# EAGLE design sensor-fusion (EAGLE 9.6.2)
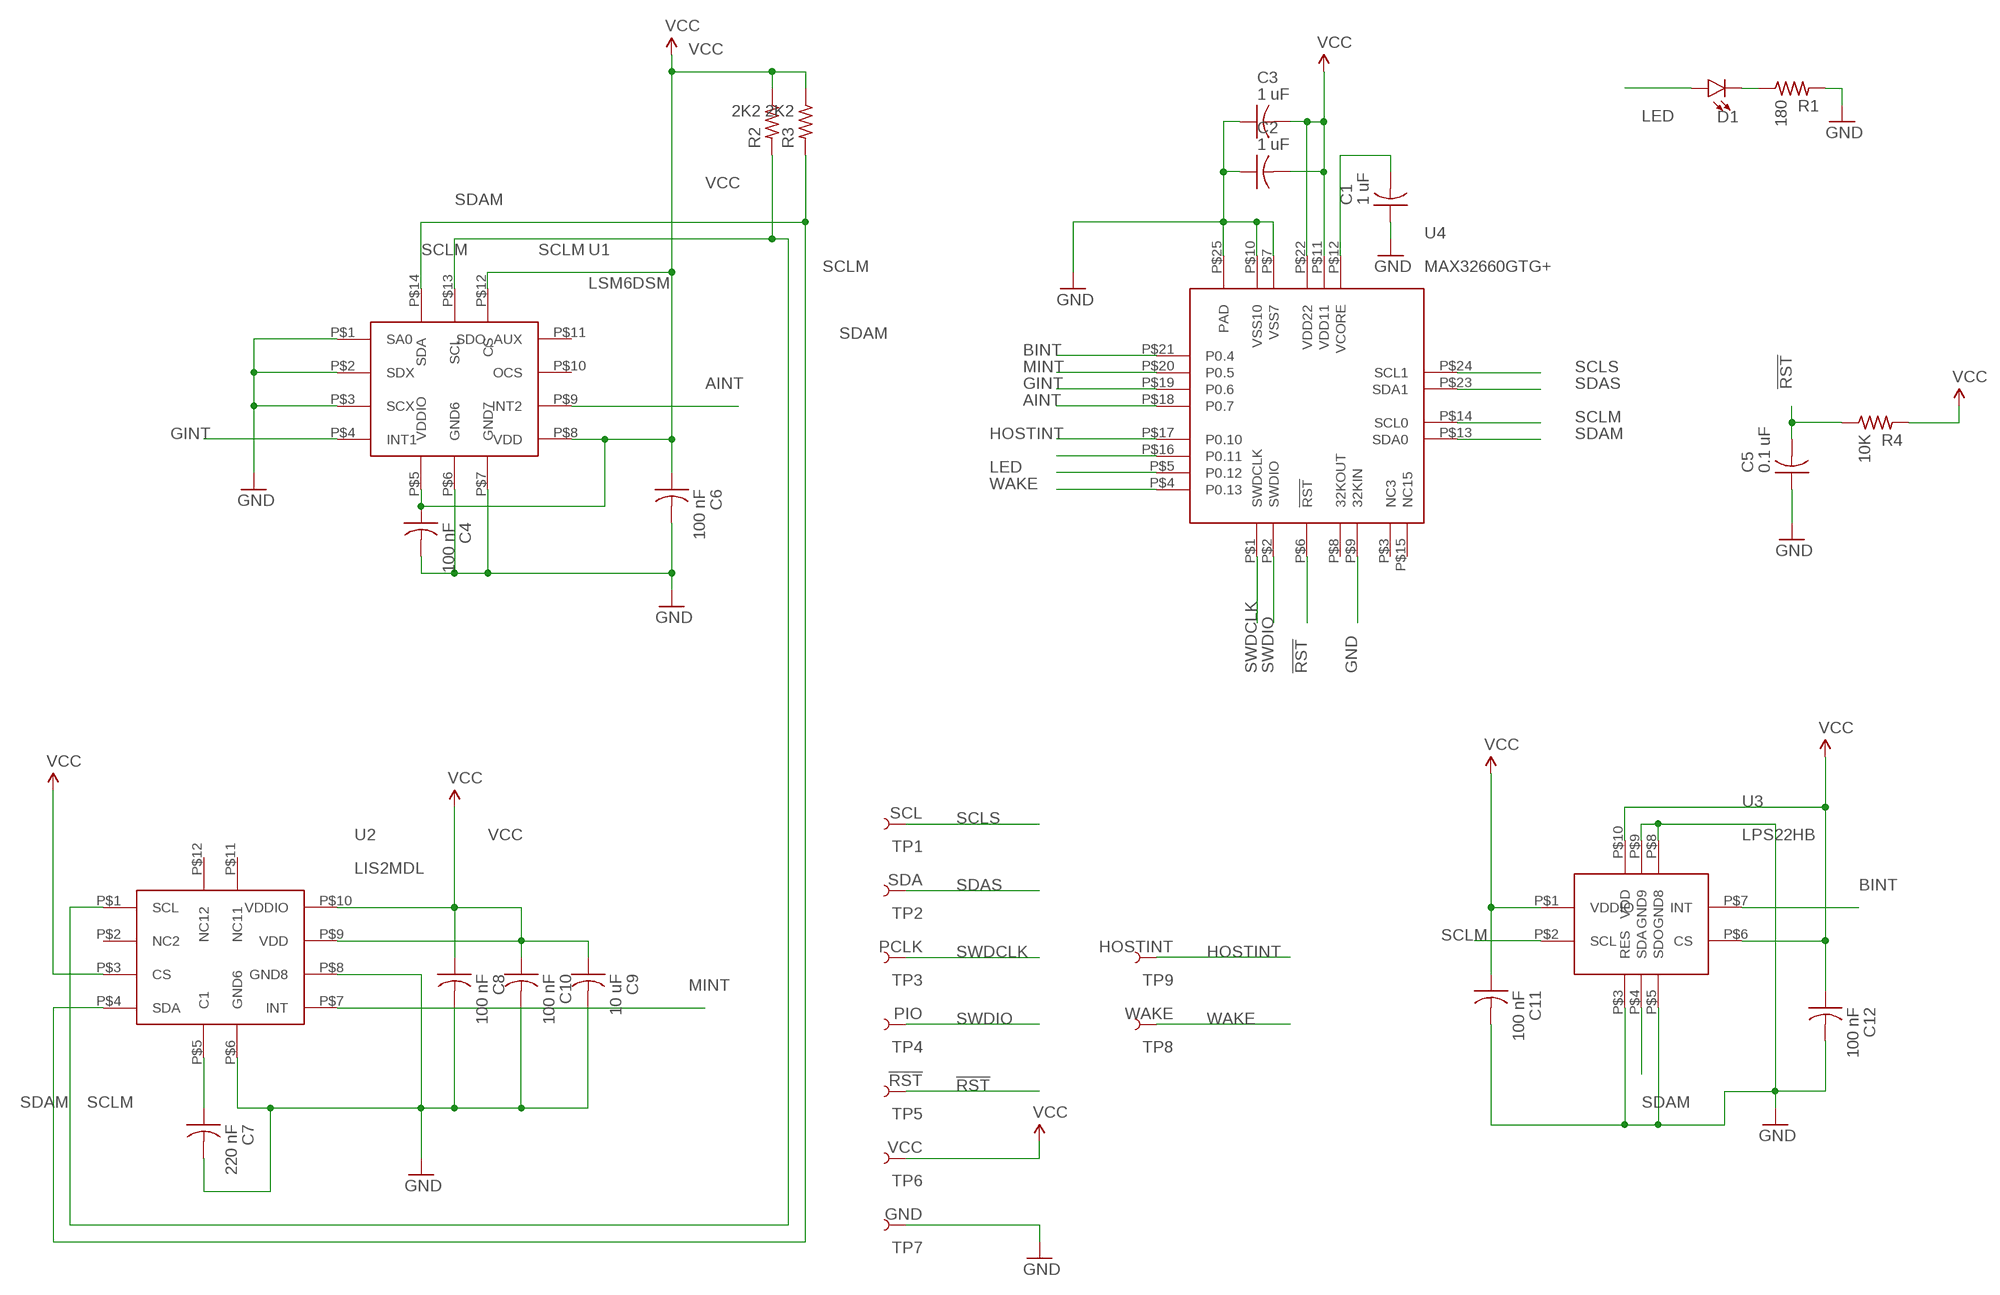
[diagram p0: schematic, sheet 1]

## Parts
C1  1 uF  C-US  [C0402_B]
C2  1 uF  C-US  [C0402_B]
C3  1 uF  C-US  [C0402_B]
C4  100 nF  C-US  [C0402_B]
C5  0.1 uF  C-US  [C0402_B]
C6  100 nF  C-US  [C0402_B]
C7  220 nF  C-US  [C0402_B]
C8  100 nF  C-US  [C0402_B]
C9  10 uF  C-US  [C0402_B]
C10  100 nF  C-US  [C0402_B]
C11  100 nF  C-US  [C0402_B]
C12  100 nF  C-US  [C0402_B]
D1  LED0603  [LED-0603]
R1  180  R-US_  [R0402_B]
R2  2K2  R-US_  [R0402_B]
R3  2K2  R-US_  [R0402_B]
R4  10K  R-US_  [R0402_B]
TP1  SCL  TEST-POINT3X6  [PAD.03X.06]
TP2  SDA  TEST-POINT3X6  [PAD.03X.06]
TP3  PCLK  TEST-POINT3X6  [PAD.03X.06]
TP4  PIO  TEST-POINT3X6  [PAD.03X.06]
TP5  !RST  TEST-POINT3X6  [PAD.03X.06]
TP6  VCC  TEST-POINT3X6  [PAD.03X.06]
TP7  GND  TEST-POINT3X6  [PAD.03X.06]
TP8  WAKE  TEST-POINT3X6  [PAD.03X.06]
TP9  HOSTINT  TEST-POINT3X6  [PAD.03X.06]
U1  LSM6DSM  [LSM6DSM]
U2  LIS2MDL  [LIS2MDL]
U3  LPS22HB  [LPS22HB]
U4  MAX32660GTG+  [MAX32660GTG+]

## Nets
!RST: C5.2 R4.1 TP5.1 U4.P$6(!RST)
AINT: U1.P$9(INT2) U4.P$18(P0.7)
BINT: U3.P$7(INT) U4.P$21(P0.4)
GINT: U1.P$4(INT1) U4.P$19(P0.6)
GND: C1.1 C2.1 C3.1 C4.2 C5.1 C6.2 C7.2 C8.2 C9.2 C10.2 C11.2 C12.2 R1.2 TP7.1 U1.P$1(SA0) U1.P$2(SDX) U1.P$3(SCX) U1.P$6(GND6) U1.P$7(GND7) U2.P$6(GND6) U2.P$8(GND8) U3.P$3(RES) U3.P$5(SDO) U3.P$8(GND8) U3.P$9(GND9) U4.P$7(VSS7) U4.P$9(32KIN) U4.P$10(VSS10) U4.P$25(PAD)
HOSTINT: TP9.1 U4.P$17(P0.10)
LED: D1.A U4.P$5(P0.12)
MINT: U2.P$7(INT) U4.P$20(P0.5)
N$4: C7.1 U2.P$5(C1)
N$6: C1.2 U4.P$12(VCORE)
N$7: D1.C R1.1
N$8: U4.P$16(P0.11)
SCLM: R2.2 U1.P$13(SCL) U2.P$1(SCL) U3.P$2(SCL) U4.P$14(SCL0)
SCLS: TP1.1 U4.P$24(SCL1)
SDAM: R3.2 U1.P$14(SDA) U2.P$4(SDA) U3.P$4(SDA) U4.P$13(SDA0)
SDAS: TP2.1 U4.P$23(SDA1)
SWDCLK: TP3.1 U4.P$1(SWDCLK)
SWDIO: TP4.1 U4.P$2(SWDIO)
VCC: C2.2 C3.2 C4.1 C6.1 C8.1 C9.1 C10.1 C11.1 C12.1 R2.1 R3.1 R4.2 TP6.1 U1.P$5(VDDIO) U1.P$8(VDD) U1.P$12(CS) U2.P$3(CS) U2.P$9(VDD) U2.P$10(VDDIO) U3.P$1(VDDIO) U3.P$6(CS) U3.P$10(VDD) U4.P$11(VDD11) U4.P$22(VDD22)
WAKE: TP8.1 U4.P$4(P0.13)
Unconnected: U2.P$2(NC2) U2.P$11(NC11) U2.P$12(NC12) U4.P$3(NC3) U4.P$8(32KOUT) U4.P$15(NC15)

## Power pins joined to a net without a drawn wire
OCS: U1.P$10(OCS)
SDO_AUX: U1.P$11(SDO_AUX)

## Library data of the parts
C1-C12 = Spark:C-US: Capacitor
D1 = SparkFun-LED:LED: LED (Generic) Standard schematic elements and footprints for 5mm, 3mm, 1206, and 0603 sized LEDs. Generic LEDs with no color specified.
R1-R4 = Spark:R-US_: 0402 Resistor
TP1-TP9 = test-pad:TEST-POINT: SparkFun Test Points Bare copper test points for troubleshooting or In-Circuit-Testing. These are used by our Production team for verifying production board runs using pogo-pins on test beds. SparkFun Products: SparkFun LSM9DS1 Breakout <https://www.sparkfun.com/products/13284> SparkFun PSOC <https://www.sparkfun.com/products/13714> SparkFun Load Cell Amplifier <https://www.sparkfun.com/products/13879>
U1 = Kris:LSM6DSM: LSM6DSM ST accel/gyro
U2 = Kris:LIS2MDL: LIS2MDL ST magnetomneter
U3 = Kris:LPS22HB: LPS22HB ST pressure sensor http://www.st.com/content/ccc/resource/technical/document/datasheet/bf/c1/4f/23/61/17/44/8a/DM00140895.pdf/files/DM00140895.pdf/jcr:content/translations/en.DM00140895.pdf
U4 = Kris:MAX32660GTG+: MAX32660GTG+ 3 mm x 3 mm 24-pin TQFN package https://pdfserv.maximintegrated.com/land_patterns/90-100089.PDF https://datasheets.maximintegrated.com/en/ds/MAX32660.pdf

## Board
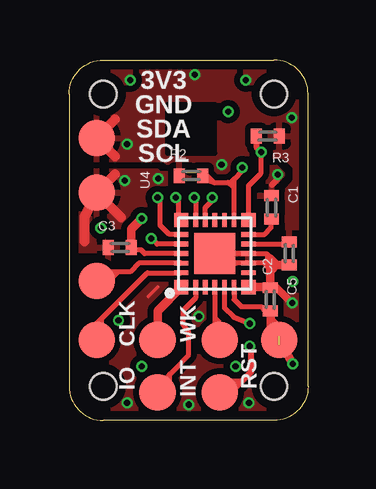
[diagram p1: board, top side]
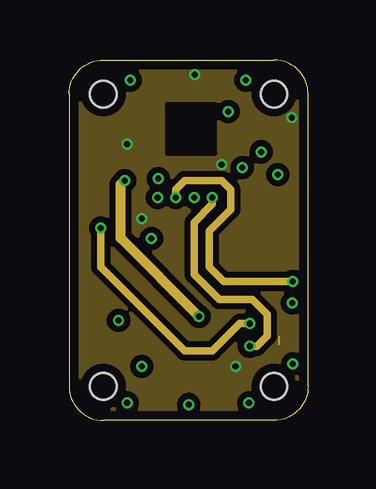
[diagram p2: board, inner layer Route2]
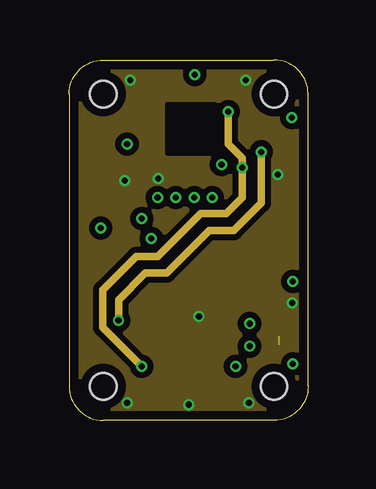
[diagram p3: board, inner layer Route15]
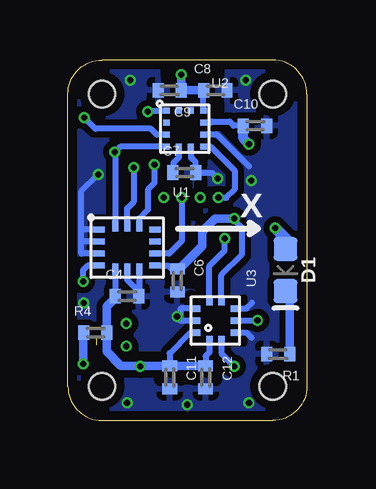
[diagram p4: board, bottom side, seen from below]

Size 9.96 x 15.04 mm. Coordinates in mm from the lower left corner, seen from the top.
Outline: 9.96,1.42 9.96,13.61 arc90 8.53,15.04 1.42,15.04 arc90 0,13.61 0,1.42 arc90 1.42,0 8.53,0 arc90 9.96,1.42
Copper layers (1*2*15*16): Top 0.035559375mm / dielectric 0.17018125mm / Route2 0.01778125mm / dielectric 47mil / Route15 0.01778125mm / dielectric 0.17018125mm / Bottom 0.035559375mm
Design rules "OSHPark-4layer *": minimum track width 5mil, minimum drill 10mil, track to track 5mil, track to pad 5mil, pad to pad 5mil, via to via 5mil, smd to smd 5mil, copper to edge 15mil, drill to drill 6mil, minimum pad ring 4mil, minimum via ring 4mil, stop-mask expansion 4mil, vias tented up to drill 20mil, thermal gap 10mil
Holes 1.1 mm at 1.42,1.42 8.53,1.42 8.53,13.61 1.42,13.61
tRestrict: area 8.9,5.6 to 9,5.6; area 7.8,5.8 to 7.8,5.8; area 7.8,5.3 to 7.8,5.3; area 4.2,4.4 to 4.3,4.5; area 7.9,5.9 to 8.6,7; area 8.4,7.6 to 8.8,7.7; area 9.6,7.4 to 9.7,7.7; area 4.2,4.2 to 4.3,4.4; area 7.3,5.1 to 8.6,5.1; area 8.6,5 to 8.7,5.1; area 9.7,6.5 to 9.8,6.7; area 8.9,6.8 to 9.6,6.9; 11 more areas
bRestrict: area 6.2,8.6 to 6.3,8.6; area 5.7,7.8 to 5.7,7.9; area 5.7,8.4 to 5.7,8.5; area 7.5,5.6 to 7.5,5.6; area 4.6,8.6 to 4.7,8.6; area 4.4,10.8 to 4.4,10.9; area 0.3,6.1 to 1.3,6.4; area 4.4,9.8 to 4.4,9.9; area 4,9.5 to 4.1,9.5; area 7.7,4.4 to 7.9,4.5; area 7.6,4.5 to 7.7,4.7; area 4.4,5.7 to 4.6,6.3; 24 more areas

### Footprints (pad centres in the part's own frame; a part is rotated, then mirrored left to right if it is on the bottom)
C0402_B = smd 0.457 x 0.61: 1 -0.483,0; 2 0.483,0
LED-0603 = smd 1 x 1: A -0.877,0; C 0.877,0
R0402_B = smd 0.457 x 0.61: 1 -0.483,0; 2 0.483,0
PAD.03X.06 = smd 1.524 x 1.524: 1 0,0
LSM6DSM = smd 0.475 x 0.25: P$1 -1.163,0.75; P$2 -1.163,0.25; P$3 -1.163,-0.25; P$4 -1.163,-0.75; P$8 1.163,-0.75; P$9 1.163,-0.25; P$10 1.163,0.25; P$11 1.163,0.75 | smd 0.25 x 0.475: P$5 -0.5,-0.912; P$6 0,-0.912; P$7 0.5,-0.912; P$12 0.5,0.912; P$13 0,0.912; P$14 -0.5,0.912
LIS2MDL = smd 0.275 x 0.25: P$1 -0.765,0.75; P$2 -0.765,0.25; P$3 -0.765,-0.25; P$4 -0.765,-0.75; P$7 0.765,-0.75; P$8 0.765,-0.25; P$9 0.765,0.25; P$10 0.765,0.75 | smd 0.25 x 0.275: P$5 -0.25,-0.765; P$6 0.25,-0.765; P$11 0.25,0.765; P$12 -0.25,0.765
LPS22HB = smd 0.3 x 0.275: P$1 -0.787,0.25; P$2 -0.787,-0.25; P$6 0.787,-0.25; P$7 0.787,0.25 | smd 0.275 x 0.3: P$3 -0.5,-0.787; P$4 0,-0.787; P$5 0.5,-0.787; P$8 0.5,0.787; P$9 0,0.787; P$10 -0.5,0.787
MAX32660GTG+ = smd 0.6 x 0.6: P$1 -1.4,1.4; P$7 -1.4,-1.4; P$13 1.4,-1.4; P$19 1.4,1.4 | smd 0.6 x 0.2: P$2 -1.4,0.8; P$3 -1.4,0.4; P$4 -1.4,0; P$5 -1.4,-0.4; P$6 -1.4,-0.8; P$14 1.4,-0.8; P$15 1.4,-0.4; P$16 1.4,0; P$17 1.4,0.4; P$18 1.4,0.8 | smd 0.2 x 0.6: P$8 -0.8,-1.4; P$9 -0.4,-1.4; P$10 0,-1.4; P$11 0.4,-1.4; P$12 0.8,-1.4; P$20 0.8,1.4; P$21 0.4,1.4; P$22 0,1.4; P$23 -0.4,1.4; P$24 -0.8,1.4 | smd 1.7 x 1.7: P$25 0,0

### Placement (x,y rotation side)
C1  8.43,8.89 270 top
C2  9.17,6.96 90 top
C3  2.11,7.21 0 top
C4  7.49,5.18 0 bottom
C5  8.38,5.05 270 top
C6  5.4,5.84 270 bottom
C7  5.11,10.34 0 bottom
C8  3.81,13.77 0 bottom
C9  5.71,13.77 180 bottom
C10  2.16,12.29 0 bottom
C11  5.71,1.8 270 bottom
C12  4.22,1.8 270 bottom
D1  0.89,6.27 270 bottom
R1  1.19,2.77 180 bottom
R2  5.08,10.21 0 top
R3  8.28,11.86 180 top
R4  8.81,3.66 0 bottom
TP1  1.14,3.35 0 top
TP2  1.14,5.82 0 top
TP3  3.68,3.35 0 top
TP4  3.68,1.17 0 top
TP5  8.76,3.35 0 top
TP6  1.14,11.79 0 top
TP7  1.14,9.5 0 top
TP8  6.27,3.35 0 top
TP9  6.27,1.17 0 top
U1  7.49,7.21 0 bottom
U2  5.08,12.17 0 bottom
U3  3.81,4.17 90 bottom
U4  6.07,6.96 90 top

### Tracks (layer width: path | path; a pad name or v marks a point on that pad's centre or on a via)
!RST  (via drill 0.25)  (2 unrouted)
  Top 0.203: U4.P$6 6.87,5.04 7.16,4.75 8,4.75 8.18,4.57 C5.2 8.41,4.55 | 8.76,3.15 8.86,3.15 8.91,3.21 8.91,3.66
  Top 0.254: 8.94,3.43 8.87,3.51 8.76,3.51
  Top 0.356: 8.91,3.66 8.41,4.17 | 8.41,4.55 8.41,4.17 | 8.41,4.17 8.41,3.86 | TP5.1 v9.32,2.36
  Bottom 0.254: R4.1 9.32,3.63
  Bottom 0.356: 9.32,3.63 v9.32,2.36
AINT  (via drill 0.25)
  Top 0.203: v5.21,9.3 5.27,9.23 U4.P$18
  Bottom 0.203: U1.P$9
  Bottom 0.254: U1.P$9 5.74,6.96 5.21,7.49 v5.21,9.3
BINT  (via drill 0.25)
  Top 0.203: U4.P$21 3.66,7.36 v3.43,7.59
  Bottom 0.203: U3.P$7
  Bottom 0.254: U3.P$7 4.06,6.45 3.43,7.09 v3.43,7.59
CUTOUT
  cutout Route2: 7.75,14.71 7.75,14.33 8.25,14.33 8.25,14.71
  cutout Route2: 1.65,14.71 1.65,14.33 2.16,14.33 2.16,14.71
  cutout Route2: 7.87,0.61 7.87,0.23 8.38,0.23 8.38,0.61
GINT  (via drill 0.25)
  Top 0.203: v4.44,9.3 4.55,9.19 4.55,8.48 U4.P$19
  Route2 0.305: v4.44,9.3 4.44,9.63 4.83,10.01 6.35,10.01 6.73,9.63 6.73,8.79 5.84,7.9 5.84,6.4 6.45,5.79 v9.32,5.79
  Bottom 0.254: U1.P$4 9.13,6.46 9.32,6.27 v9.32,5.79
GND  (via drill 0.25)
  Top 0.152: 3.68,5.56 3.3,5.18
  Top 0.203: 8.22,6.96 U4.P$10 U4.P$25 6.47,6.56 U4.P$9 8.13,6.56 | 8.38,6.56 8.25,6.56 | 8.25,6.56 8.13,6.56 | 8.22,6.96 8.38,6.83 | 8.38,6.83 8.38,6.56 | 8.38,6.56 8.38,6.45 8.41,6.48 | 8.38,6.2 8.38,6.31 8.13,6.56 | 8.38,6.83 8.74,6.48 8.89,6.48 | 8.22,6.96 8.25,6.92 8.25,6.56
  Top 0.254: v9.3,4.9 9.27,4.9 | 8.36,5.56 C5.1 | 8.46,9.83 8.66,10.03
  Top 0.305: 9.27,4.9 8.64,5.54 C5.1
  Top 0.356: U4.P$7 8.36,5.56 | C5.1 8.38,6.2 8.38,6.22 | 8.38,6.22 8.38,6.45 | C2.1 8.89,6.48 8.64,6.48 | 8.64,6.48 8.41,6.48 | 8.38,6.22 8.64,6.48
  Top 0.406: TP7.1 0.64,8.48 0.64,7.47 | TP7.1 2.16,8.48 | TP7.1 1.91,10.26
  Route2 0.406: v5.41,4.34 2.15,7.61 2.15,9.84 v2.31,10.01
  Bottom 0.203: U1.P$6 7.49,5.99 | C4.2 6.97,5.2
  Bottom 0.254: U1.P$1 9.4,7.96 | U1.P$2 9.4,7.46 | U1.P$3 9.4,6.96 9.4,7.46 | U3.P$5 2.52,4.67 2.29,4.9 | U3.P$3 2.52,3.67 2.31,3.45 | 9.4,7.46 9.4,7.96 | U1.P$7 6.99,5.37 | U1.P$6 7.49,5.87 6.99,5.37 | U3.P$8 5.27,4.67 5.27,4.17 U3.P$9 | U2.P$6 4.83,10.98 4.65,10.79 4.65,10.36 C7.2 3.96,10.34 v3.71,10.08 | 6.99,5.37 6.99,5.19 C4.2 | C12.2 4.22,1.24 | 2.41,10.6 3.73,11.92 U2.P$8 | 9.4,7.96 9.4,9.56 v8.7,10.26
  other vias: 7.37,14.2 2.54,14.2 2.41,0.74 4.98,0.66 7.49,0.74
  pour Route15 (isolate 0.254): 1.4,15.09 8.76,15.09 arc-90 10.03,13.82 10.03,1.37 arc-90 8.51,-0.15 1.4,-0.15 arc-90 -0.13,1.37 -0.13,13.56 arc-90
  pour Bottom (isolate 0.254): 1.4,15.09 8.76,15.09 arc-90 10.03,13.82 10.03,1.37 arc-90 8.51,-0.15 1.4,-0.15 arc-90 -0.13,1.37 -0.13,13.56 arc-90
  pour Top (isolate 0.254, rank 2): 1.4,15.09 8.76,15.09 arc-90 10.03,13.82 10.03,1.37 arc-90 8.51,-0.15 1.4,-0.15 arc-90 -0.13,1.37 -0.13,13.56 arc-90
HOSTINT  (via drill 0.25)
  Top 0.203: U4.P$17 5.67,8.87 5.97,9.17 v5.97,9.3
  Top 0.254: v7.52,3.1 7.57,3.05 7.57,2.01 6.73,1.17 TP9.1 | TP9.1 6.73,1.63 7.19,1.63 | 6.22,1.12 TP9.1
  Route2 0.305: v5.97,9.3 5.97,9.02 5.21,8.25 5.21,6.1 6.25,5.05 7.62,5.05 8.25,4.42 8.25,3.53 7.82,3.1 v7.52,3.1
LED  (via drill 0.25)
  Top 0.203: U4.P$5 6.47,4.69 6.86,4.32 v7.52,4.04
  Route2 0.305: v7.52,4.04 7.11,4.04 5.97,2.9 4.83,2.9 1.32,6.4 v1.32,8.03
  Bottom 0.254: 0.95,7.09 D1.A
  Bottom 0.457: v1.32,8.03 1.09,7.8 1.09,7.42 | v1.32,8.03 0.95,7.66 0.95,7.09 | v1.32,8.03 0.66,7.37 0.66,7.21
MINT  (via drill 0.25)
  Top 0.203: U4.P$20 4.18,7.76 3.79,8.15 3.79,9.19 v3.68,9.3
  Bottom 0.203: U2.P$7 4.05,11.4
  Bottom 0.254: U2.P$7 4,11.42 3.01,10.43 3.01,9.64 3.35,9.3 v3.68,9.3
N$1
  cutout Bottom (no thermals): 6.07,13.18 4.09,13.18 4.09,11.15 6.07,11.15
  cutout Route2 (no thermals): 6.07,13.18 4.09,13.18 4.09,11.15 6.07,11.15
  cutout Route15 (no thermals): 6.07,13.18 4.09,13.18 4.09,11.15 6.07,11.15
  cutout Top (no thermals): 6.07,13.18 4.09,13.18 4.09,11.15 6.07,11.15
N$3
  cutout Bottom: 4.55,3.17 4.55,5.16 2.59,5.16 2.59,3.17
N$4
  Bottom 0.254: U2.P$5 5.33,10.97 5.56,10.74 5.56,10.36 C7.1
N$5
  cutout Bottom: 9.03,8.5 5.96,8.5 5.96,5.96 9.03,5.96
N$6
  Top 0.203: U4.P$12 8.14,7.76 8.41,8.03 8.41,8.38 C1.2
N$7
  Bottom 0.356: R1.1 0.71,5.22 D1.C
SCLM  (via drill 0.25)
  Top 0.203: v7.21,10.54 7.21,10.41 6.87,10.07 | 6.87,10.07 6.77,9.97 6.77,9.93 6.63,9.93 | R2.2 5.74,10.21 6.02,9.93 | 6.02,9.93 6.63,9.93 | 6.02,9.93 5.46,10.11 | 6.87,9.69 6.63,9.93 | U4.P$14 6.87,10.07
  Route15 0.305: v3.02,2.26 1.4,3.89 1.4,5.44 2.79,6.83 3.68,6.83 5.49,8.64 6.55,8.64 7.21,9.3 v7.21,10.54 7.21,10.95 6.63,11.53 v6.63,12.88
  Bottom 0.254: U1.P$13 7.49,8.84 7.21,9.12 v7.21,10.54 | U3.P$2 3.56,2.8 v3.02,2.26 | v6.63,12.88 6.59,12.92 U2.P$1
SCLS
  Top 0.203: TP1.1 1.14,4.04 1.35,4.24 | 1.35,4.24 1.35,3.73 | 1.35,4.24 3.26,6.16 U4.P$24
SDAM  (via drill 0.25)
  Top 0.203: v8,11.2 7.98,11.18 7.98,10.29 7.47,9.78 U4.P$13
  Top 0.254: R3.2 7.8,11.4 v8,11.2
  Route15 0.305: v8,11.2 8,9.07 6.86,7.92 5.84,7.92 4.06,6.15 3.17,6.15 2.06,5.03 v2.06,4.17
  Bottom 0.254: U3.P$4 v2.06,4.17 | v8,11.2 v7.99,11.19 | v7.99,11.19 U1.P$14 | U2.P$4 7.77,11.42 v7.99,11.19
SDAS
  Top 0.203: 2.03,6.2 1.65,5.82 TP2.1 | U4.P$23 2.9,6.56 2.54,6.2 2.03,6.2 | 2.03,6.2 1.65,6.2
SWDCLK
  Top 0.203: U4.P$1 4.62,5.56
  Top 0.356: TP3.1 3.68,4.57 U4.P$1
SWDIO
  Top 0.203: 4.19,1.93 4.19,1.57 4.09,1.57 TP4.1 3.68,1.4 4.98,2.74 4.98,3.71 4.75,3.99 4.75,4.6 5.27,5.12 U4.P$2
VCC  (via drill 0.25)
  Top 0.203: U4.P$22 3.15,6.96 3,7.11 2.69,7.11 C3.2 2.72,7.34 | C2.2 9.07,7.44 8.98,7.36 U4.P$11
  Top 0.254: 4.6,10.26 R2.1
  Top 0.305: R2.1 4.55,10.21
  Top 0.356: v3.02,8.42 2.59,7.99 C3.2
  Top 0.406: TP6.1 1.91,12.55 | TP6.1 1.19,11.73 | TP6.1 1.91,11.02
  Bottom 0.203: U3.P$6
  Bottom 0.254: U1.P$8 5.78,6.46 5.64,6.32 C6.1 | v6.35,10.67 6.35,9.91 6.63,9.63 6.63,8.79 6.99,8.43 U1.P$12 | U3.P$6 3.56,6.07 2.72,6.91 2.72,8.04 3.02,8.34 v3.02,8.42 | 7.95,5.21 C4.1 | U3.P$10 4.85,3.67 5.71,2.8 C11.1 | U1.P$5 7.99,5.22 C4.1 | 7.98,5.11 C4.1 | 8.33,3.61 R4.2 | U2.P$3 6.25,11.92 6.5,12.17 8.81,12.17 v9.27,12.62 | U2.P$9 4.01,12.42 3.96,12.47 3.22,12.47 3.05,12.29 C10.1 | U2.P$10 4.31,13.74 C8.1 | U3.P$1 4.06,2.85 4.22,2.69 C12.1 | 6.91,2.29 v6.93,2.26 6.96,2.29
  Bottom 0.356: C6.1 5.32,6.32 4.37,7.28 4.37,7.87 3.82,8.42 v3.02,8.42 | C12.1 C11.1 6.91,2.29 | 7.98,5.11 8.33,4.75 R4.2 8.33,2.87 7.75,2.29 6.96,2.29 | v5.23,14.43 C9.1 C8.1
  Bottom 0.406: v2.41,11.53 2.64,11.76 C10.1
  pour Route2 (isolate 0.254): 1.4,15.09 8.76,15.09 arc-90 10.03,13.82 10.03,1.37 arc-90 8.51,-0.15 1.4,-0.15 arc-90 -0.13,1.37 -0.13,13.56 arc-90
  pour Top (isolate 0.254): 9.96,11.28 9.95,11.28 9.91,13.59 arc90 8.38,14.96 1.52,14.96 arc90 0.13,13.56 0.13,10.87 3.99,10.87 4.85,10.01 6.98,10.01 8,11.02 8.97,11.02 9.41,10.58 9.41,9.98 8.97,9.49 8.97,7.34 9.96,7.34
WAKE
  Top 0.203: TP8.1 6.27,4.06 6.07,4.27 | U4.P$4 6.07,4.27 | 6.07,4.27 6.07,3.96

### Text on the board
tPlace: 3V3 | GND | SDA | SCL | CLK | WK | IO | INT | RST
bPlace: X